# Altium schematic sheet MyMinimig.SchDoc
size 660 x 398 mm
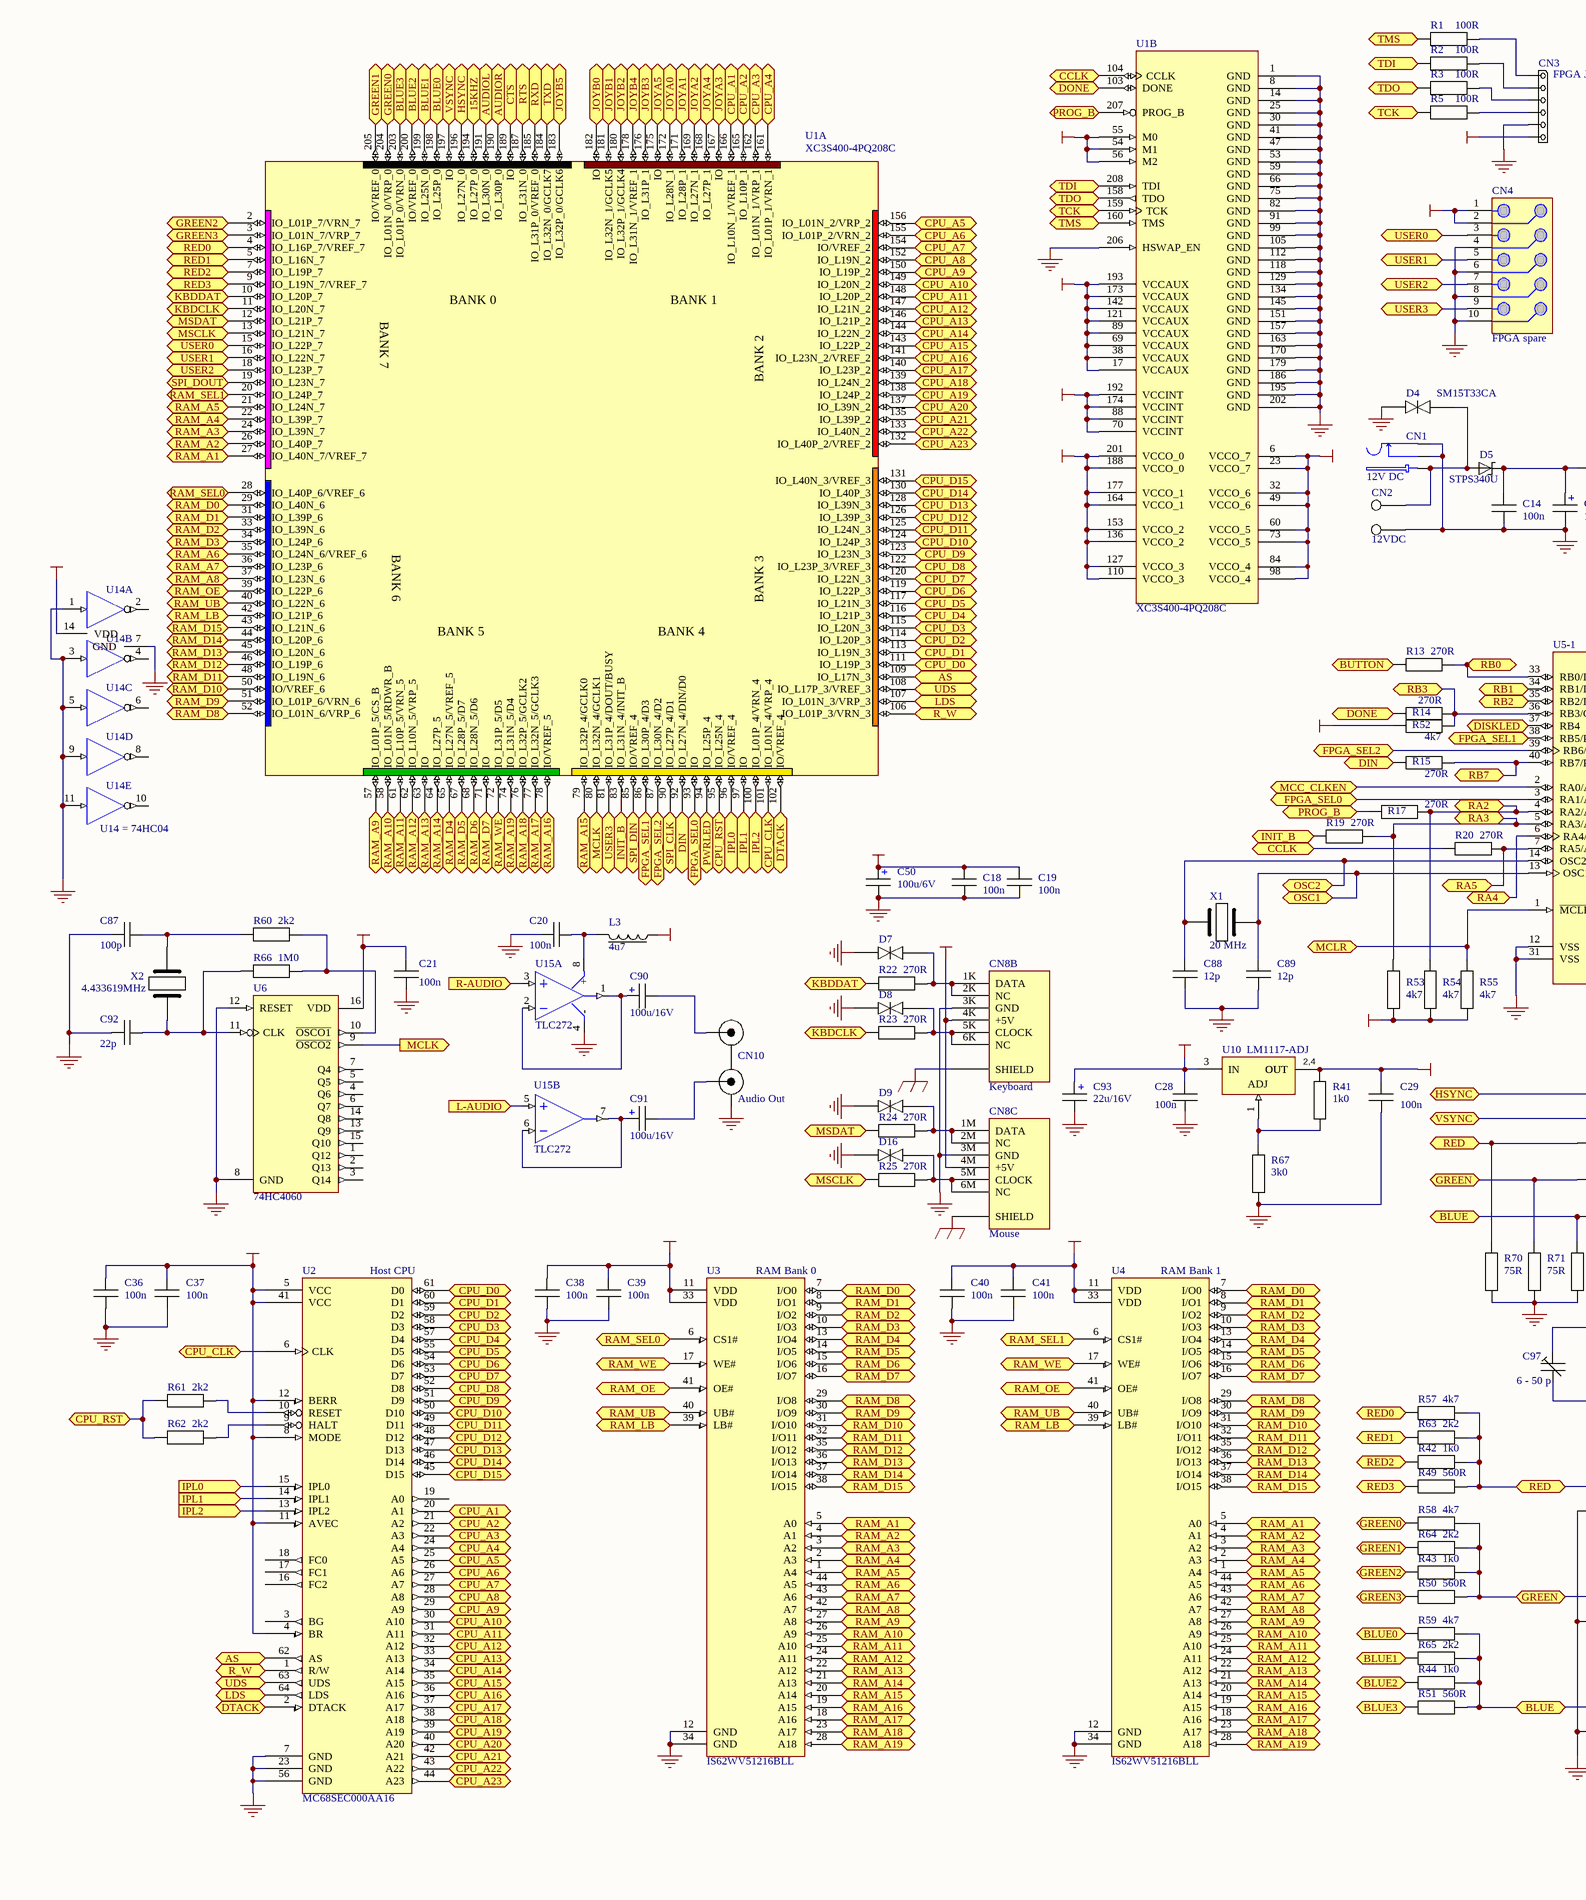
[diagram p0: MyMinimig.SchDoc, bottom left]
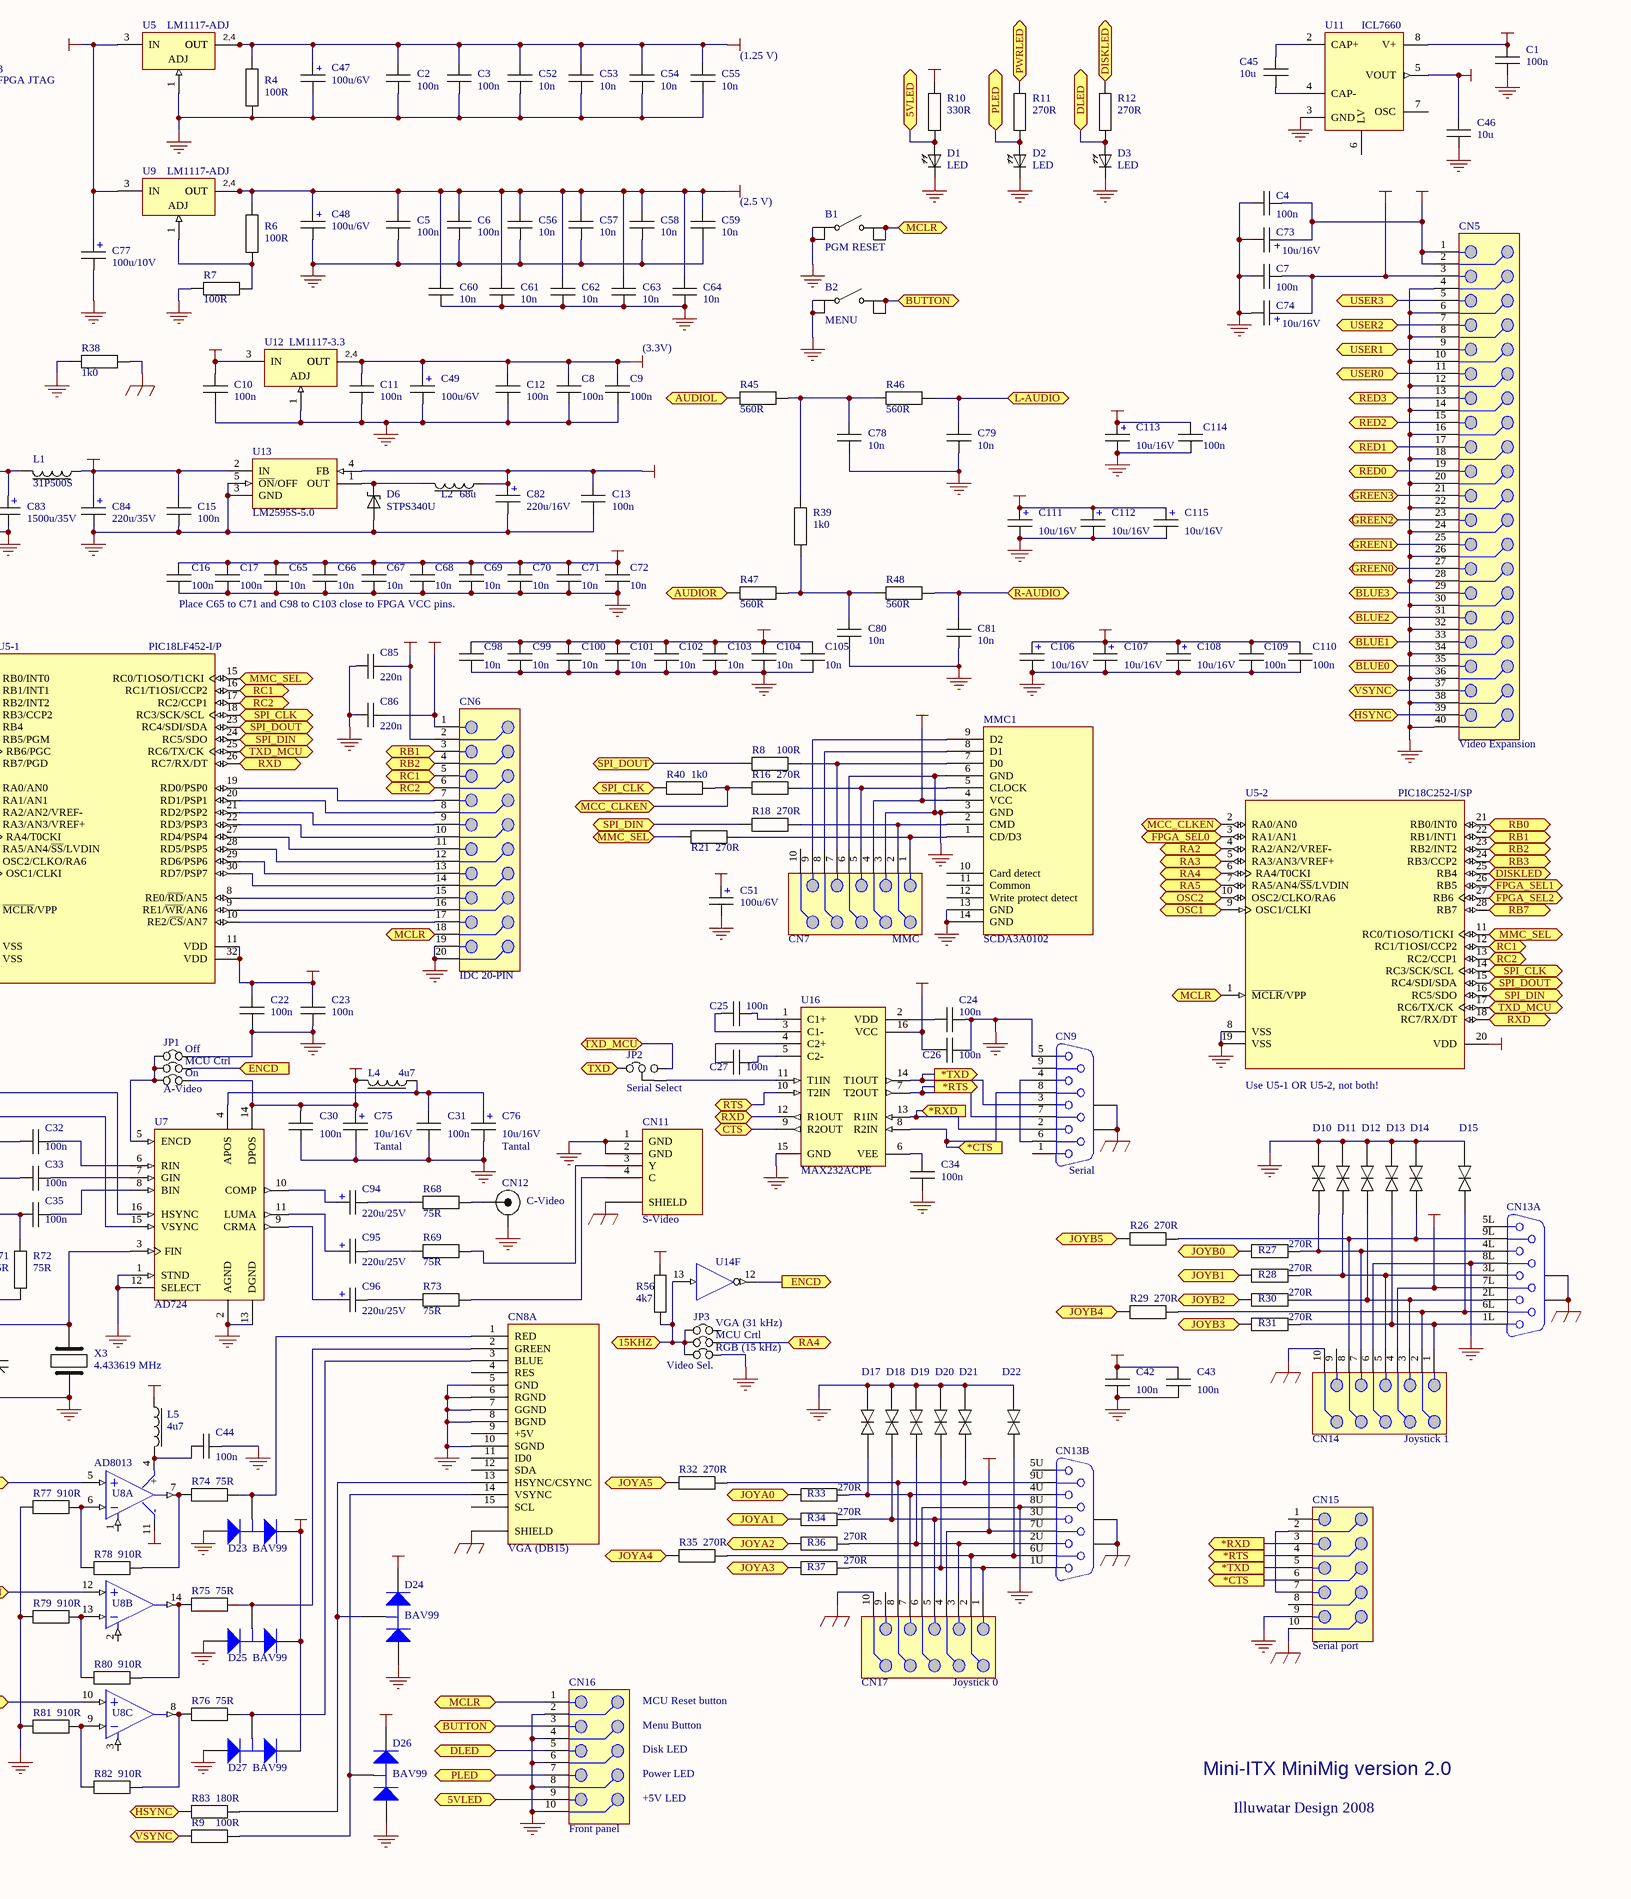
[diagram p1: MyMinimig.SchDoc, bottom right]

## Parts
B1  PGM RESET  [Pushbutton PCB 6x6]
B2  MENU  [Pushbutton PCB 6x6]
C1  100n  [CC2013-0805]
C2  100n  [CC2013-0805]
C3  100n  [CC2013-0805]
C4  100n  [CC2013-0805]
C5  100n  [CC2013-0805]
C6  100n  [CC2013-0805]
C7  100n  [CC2013-0805]
C8  100n  [CC2013-0805]
C9  100n  [CC2013-0805]
C10  100n  [CC2013-0805]
C11  100n  [CC2013-0805]
C12  100n  [CC2013-0805]
C13  100n  [CC2013-0805]
C14  100n  [CC2013-0805]
C15  100n  [CC2013-0805]
C16  100n  [CC2013-0805]
C17  100n  [CC2013-0805]
C18  100n  [CC2013-0805]
C19  100n  [CC2013-0805]
C20  100n  [CC2013-0805]
C21  100n  [CC2013-0805]
C22  100n  [CC2013-0805]
C23  100n  [CC2013-0805]
C24  100n  [CC2013-0805]
C25  100n  [CC2013-0805]
C26  100n  [CC2013-0805]
C27  100n  [CC2013-0805]
C28  100n  [CC2013-0805]
C29  100n  [CC2013-0805]
C30  100n  [CC2013-0805]
C31  100n  [CC2013-0805]
C32  100n  [CC2013-0805]
C33  100n  [CC2013-0805]
C34  100n  [CC2013-0805]
C35  100n  [CC2013-0805]
C36  100n  [CC2013-0805]
C37  100n  [CC2013-0805]
C38  100n  [CC2013-0805]
C39  100n  [CC2013-0805]
C40  100n  [CC2013-0805]
C41  100n  [CC2013-0805]
C42  100n  [CC2013-0805]
C43  100n  [CC2013-0805]
C44  100n  [CC2013-0805]
C45  10u  [CC3216-1206]
C46  10u  [CC3216-1206]
C47  100u/6V  [TC7343-2917]
C48  100u/6V  [TC7343-2917]
C49  100u/6V  [TC7343-2917]
C50  100u/6V  [TC7343-2917]
C51  100u/6V  [TC7343-2917]
C52  10n  [CC2013-0805]
C53  10n  [CC2013-0805]
C54  10n  [CC2013-0805]
C55  10n  [CC2013-0805]
C56  10n  [CC2013-0805]
C57  10n  [CC2013-0805]
C58  10n  [CC2013-0805]
C59  10n  [CC2013-0805]
C60  10n  [CC2013-0805]
C61  10n  [CC2013-0805]
C62  10n  [CC2013-0805]
C63  10n  [CC2013-0805]
C64  10n  [CC2013-0805]
C65  10n  [CC2013-0805]
C66  10n  [CC2013-0805]
C67  10n  [CC2013-0805]
C68  10n  [CC2013-0805]
C69  10n  [CC2013-0805]
C70  10n  [CC2013-0805]
C71  10n  [CC2013-0805]
C72  10n  [CC2013-0805]
C73  10u/16V  [TC3528-1411]
C74  10u/16V  [TC3528-1411]
C75  10u/16V  [TC3528-1411]
C76  10u/16V  [TC3528-1411]
C77  100u/10V  [TC7343-2917]
C78  10n  [RAD-0.2]
C79  10n  [RAD-0.2]
C80  10n  [RAD-0.2]
C81  10n  [RAD-0.2]
C82  220u/16V  [Cap-E 6.6]
C83  1500u/35V  [Cap-E 16.3]
C84  220u/35V  [Cap-E 8.3]
C85  220n  [CC2013-0805]
C86  220n  [CC2013-0805]
C87  100p  [CC2013-0805]
C88  12p  [CC2013-0805]
C89  12p  [CC2013-0805]
C90  100u/16V  [R-0.15/3.2]
C91  100u/16V  [R-0.15/3.2]
C92  22p  [CC2013-0805]
C93  22u/16V  [TC6032-2412]
C94  220u/25V  [Cap-E 8.3]
C95  220u/25V  [Cap-E 8.3]
C96  220u/25V  [Cap-E 8.3]
C97  6 - 50 p  [Trimmer Cap TZ03]
C98  10n  [CC2013-0805]
C99  10n  [CC2013-0805]
C100  10n  [CC2013-0805]
C101  10n  [CC2013-0805]
C102  10n  [CC2013-0805]
C103  10n  [CC2013-0805]
C104  10n  [CC2013-0805]
C105  10n  [CC2013-0805]
C106  10u/16V  [TC3528-1411]
C107  10u/16V  [TC3528-1411]
C108  10u/16V  [TC3528-1411]
C109  100n  [CC2013-0805]
C110  100n  [CC2013-0805]
C111  10u/16V  [TC3528-1411]
C112  10u/16V  [TC3528-1411]
C113  10u/16V  [TC3528-1411]
C114  100n  [CC2013-0805]
C115  10u/16V  [TC3528-1411]
CN1  12V DC  [CHASSIDON 2.1/2.5mm]
CN2  12VDC  [CONN_1]
CN3  FPGA JTAG  [6-PIN STRIP]
CN4  FPGA spare  [N_IDC10]
CN5  Video Expansion  [40-pin Header SMD 1.27 mm]
CN6  IDC 20-PIN  [N_IDC20]
CN7  MMC  [N_IDC10]
CN8  VGA + 2 x PS/2  [VGA + 2 x PS/2]  (value not drawn)  (parts A,B,C of 3)
CN9  Serial  [DB9 Female PCB]
CN10  Audio Out  [Dual Phono PCB]
CN11  S-Video  [S-Video connector]
CN12  C-Video  [RCA RCJ-04X]
CN13  Dual DB9  [Dual DB9 male]  (value not drawn)  (parts A,B of 2)
CN14  Joystick 1  [N_IDC10]
CN15  Serial port  [N_IDC10]
CN16  Front panel  [N_IDC10]
CN17  Joystick 0  [N_IDC10]
D1  LED  [LED 3MM]
D2  LED  [LED 3MM]
D3  LED  [LED 3MM]
D4  SM15T33CA  [SOD15 UP]
D5  STPS340U  [DO-214AA SMB]
D6  STPS340U  [DO-214AA SMB]
D7  ESD  [CR1608-0603]  (value not drawn)
D8  ESD  [CR1608-0603]  (value not drawn)
D9  ESD  [CR1608-0603]  (value not drawn)
D10  ESD  [CR1608-0603]  (value not drawn)
D11  ESD  [CR1608-0603]  (value not drawn)
D12  ESD  [CR1608-0603]  (value not drawn)
D13  ESD  [CR1608-0603]  (value not drawn)
D14  ESD  [CR1608-0603]  (value not drawn)
D15  ESD  [CR1608-0603]  (value not drawn)
D16  ESD  [CR1608-0603]  (value not drawn)
D17  ESD  [CR1608-0603]  (value not drawn)
D18  ESD  [CR1608-0603]  (value not drawn)
D19  ESD  [CR1608-0603]  (value not drawn)
D20  ESD  [CR1608-0603]  (value not drawn)
D21  ESD  [CR1608-0603]  (value not drawn)
D22  ESD  [CR1608-0603]  (value not drawn)
D23  BAV99  [SOT-23]
D24  BAV99  [SOT-23]
D25  BAV99  [SOT-23]
D26  BAV99  [SOT-23]
D27  BAV99  [SOT-23]
JP1  A-Video  [STRAP-3]
JP2  Serial Select  [STRAP-3pin]
JP3  Video Sel.  [STRAP-3]
L1  31P500S  [CR3216-1206]
L2  68u  [DR74]
L3  4u7  [CR3225-1210]
L4  4u7  [CR3225-1210]
L5  4u7  [CR3225-1210]
MMC1  SCDA3A0102  [SCDA3A0102]
R1  100R  [CR2012-0805]
R2  100R  [CR2012-0805]
R3  100R  [CR2012-0805]
R4  100R  [CR2012-0805]
R5  100R  [CR2012-0805]
R6  100R  [CR2012-0805]
R7  100R  [CR2012-0805]
R8  100R  [CR2012-0805]
R9  100R  [CR2012-0805]
R10  330R  [CR3216-1206]
R11  270R  [CR3216-1206]
R12  270R  [CR3216-1206]
R13  270R  [CR2012-0805]
R14  270R  [CR2012-0805]
R15  270R  [CR2012-0805]
R16  270R  [CR2012-0805]
R17  270R  [CR2012-0805]
R18  270R  [CR2012-0805]
R19  270R  [CR2012-0805]
R20  270R  [CR2012-0805]
R21  270R  [CR2012-0805]
R22  270R  [CR2012-0805]
R23  270R  [CR2012-0805]
R24  270R  [CR2012-0805]
R25  270R  [CR2012-0805]
R26  270R  [CR2012-0805]
R27  270R  [CR2012-0805]
R28  270R  [CR2012-0805]
R29  270R  [CR2012-0805]
R30  270R  [CR2012-0805]
R31  270R  [CR2012-0805]
R32  270R  [CR2012-0805]
R33  270R  [CR2012-0805]
R34  270R  [CR2012-0805]
R35  270R  [CR2012-0805]
R36  270R  [CR2012-0805]
R37  270R  [CR2012-0805]
R38  1k0  [AXIAL-0.4]
R39  1k0  [CR2012-0805]
R40  1k0  [CR2012-0805]
R41  1k0  [CR2012-0805]
R42  1k0  [CR2012-0805]
R43  1k0  [CR2012-0805]
R44  1k0  [CR2012-0805]
R45  560R  [CR2012-0805]
R46  560R  [CR2012-0805]
R47  560R  [CR2012-0805]
R48  560R  [CR2012-0805]
R49  560R  [CR2012-0805]
R50  560R  [CR2012-0805]
R51  560R  [CR2012-0805]
R52  4k7  [CR2012-0805]
R53  4k7  [CR2012-0805]
R54  4k7  [CR2012-0805]
R55  4k7  [CR2012-0805]
R56  4k7  [CR2012-0805]
R57  4k7  [CR2012-0805]
R58  4k7  [CR2012-0805]
R59  4k7  [CR2012-0805]
R60  2k2  [CR2012-0805]
R61  2k2  [CR2012-0805]
R62  2k2  [CR2012-0805]
R63  2k2  [CR2012-0805]
R64  2k2  [CR2012-0805]
R65  2k2  [CR2012-0805]
R66  1M0  [CR2012-0805]
R67  3k0  [CR2012-0805]
R68  75R  [CR2012-0805]
R69  75R  [CR2012-0805]
R70  75R  [CR2012-0805]
R71  75R  [CR2012-0805]
R72  75R  [CR2012-0805]
R73  75R  [CR2012-0805]
R74  75R  [CR2012-0805]
R75  75R  [CR2012-0805]
R76  75R  [CR2012-0805]
R77  910R  [CR2012-0805]
R78  910R  [CR2012-0805]
R79  910R  [CR2012-0805]
R80  910R  [CR2012-0805]
R81  910R  [CR2012-0805]
R82  910R  [CR2012-0805]
R83  180R  [CR2012-0805]
U1  XC3S400-4PQ208C  [PQ208]  (parts A,B of 2)
U2  MC68SEC000AA16  [QFP14x14-G64/N]
U3  IS62WV51216BLL  [SO-G44/P.8]
U4  IS62WV51216BLL  [SO-G44/P.8]
U5  LM1117-ADJ  [318E-04]
U5-1  PIC18LF452-I/P  [PDIP600-40]
U5-2  PIC18C252-I/SP  [PDIP300-28]
U6  74HC4060  [751B-05]
U7  AD724  [SO-G16/G8.4]
U8  AD8013  [SO-G14]  (parts A,B,C of 3)
U9  LM1117-ADJ  [318E-04]
U10  LM1117-ADJ  [318E-04]
U11  ICL7660  [SO-G8]
U12  LM1117-3.3  [318E-04]
U13  LM2595S-5.0  [TS5B]
U14  MC74HC04AD  [751A-03]  (value not drawn)  (parts A,B,C,D,E,F of 6)
U15  TLC272  [DIP-8]  (parts A,B of 2)
U16  MAX232ACPE  [PE16A]
X1  20 MHz  [XTAL_HC49]
X2  4.433619MHz  [XTAL_HC49]
X3  4.433619 MHz  [XTAL_HC49]

## Ports
5VLED (bidir), 15KHZ (bidir), *CTS (in), *CTS (out), *RTS (out), *RXD (in), *RXD (out), *TXD (out), AS (bidir), AS (out), AUDIOL (bidir), AUDIOR (bidir), BLUE, BLUE0 (bidir), BLUE1 (bidir), BLUE2 (bidir), BLUE3 (bidir), BUTTON (bidir), CCLK (bidir), CPU_A1 (bidir), CPU_A2 (bidir), CPU_A3 (bidir), CPU_A4 (bidir), CPU_A5 (bidir), CPU_A6 (bidir), CPU_A7 (bidir), CPU_A8 (bidir), CPU_A9 (bidir), CPU_A10 (bidir), CPU_A11 (bidir), CPU_A12 (bidir), CPU_A13 (bidir), CPU_A14 (bidir), CPU_A15 (bidir), CPU_A16 (bidir), CPU_A17 (bidir), CPU_A18 (bidir), CPU_A19 (bidir), CPU_A20 (bidir), CPU_A21 (bidir), CPU_A22 (bidir), CPU_A23 (bidir), CPU_CLK (bidir), CPU_D0 (bidir), CPU_D1 (bidir), CPU_D2 (bidir), CPU_D3 (bidir), CPU_D4 (bidir), CPU_D5 (bidir), CPU_D6 (bidir), CPU_D7 (bidir), CPU_D8 (bidir), CPU_D9 (bidir), CPU_D10 (bidir), CPU_D11 (bidir), CPU_D12 (bidir), CPU_D13 (bidir), CPU_D14 (bidir), CPU_D15 (bidir), CPU_RST (bidir), CTS (bidir), DIN (bidir), DISKLED (bidir), DLED (bidir), DONE (bidir), DTACK (bidir), DTACK (in), ENCD (in), ENCD (out), FPGA_SEL0 (bidir), FPGA_SEL1 (bidir), FPGA_SEL2 (bidir), GREEN, GREEN0 (bidir), GREEN1 (bidir), GREEN2 (bidir), GREEN3 (bidir), HSYNC (bidir), INIT_B (bidir), IPL0 (bidir), IPL0 (in), IPL1 (bidir), IPL1 (in), IPL2 (bidir), IPL2 (in), JOYA0 (bidir), JOYA1 (bidir), JOYA2 (bidir), JOYA3 (bidir), JOYA4 (bidir), JOYA5 (bidir), JOYB0 (bidir), JOYB1 (bidir), JOYB2 (bidir), JOYB3 (bidir), JOYB4 (bidir), JOYB5 (bidir), KBDCLK (bidir), KBDDAT (bidir), L-AUDIO, L-AUDIO (in), LDS (bidir), LDS (out), MCC_CLKEN (bidir), MCLK (bidir), MCLK (out), MCLR (bidir), MMC_SEL (bidir), MSCLK (bidir), MSDAT (bidir), OSC1 (bidir), OSC2 (bidir), PLED (bidir), PROG_B (bidir), PWRLED (bidir), R-AUDIO, R-AUDIO (in), R_W (bidir), R_W (out), RA2 (bidir), RA3 (bidir), RA4 (bidir), RA5 (bidir), RAM_A1 (bidir), RAM_A2 (bidir), RAM_A3 (bidir), RAM_A4 (bidir), RAM_A5 (bidir), RAM_A6 (bidir), RAM_A7 (bidir), RAM_A8 (bidir), RAM_A9 (bidir), RAM_A10 (bidir), RAM_A11 (bidir), RAM_A12 (bidir), RAM_A13 (bidir), RAM_A14 (bidir), RAM_A15 (bidir), RAM_A16 (bidir), RAM_A17 (bidir), RAM_A18 (bidir), RAM_A19 (bidir), RAM_D0 (bidir), RAM_D1 (bidir), RAM_D2 (bidir), RAM_D3 (bidir), RAM_D4 (bidir), RAM_D5 (bidir), RAM_D6 (bidir), RAM_D7 (bidir), RAM_D8 (bidir), RAM_D9 (bidir), RAM_D10 (bidir), RAM_D11 (bidir), RAM_D12 (bidir), RAM_D13 (bidir), RAM_D14 (bidir), RAM_D15 (bidir), RAM_LB (bidir), RAM_OE (bidir), RAM_SEL0 (bidir), RAM_SEL1 (bidir), RAM_UB (bidir), RAM_WE (bidir), RB0 (bidir), RB1 (bidir), RB2 (bidir), RB3 (bidir), RB7 (bidir), RC1 (bidir), RC2 (bidir), RED, RED0 (bidir), RED1 (bidir), RED2 (bidir), RED3 (bidir), RTS (bidir), RXD (bidir), SPI_CLK (bidir), SPI_DIN (bidir), SPI_DOUT (bidir), TCK (in), TCK (out), TDI (in), TDI (out), TDO (out), TMS (in), TMS (out), TXD (bidir), TXD_MCU (bidir), UDS (bidir), UDS (out), USER0 (bidir), USER1 (bidir), USER2 (bidir), USER3 (bidir), VSYNC (bidir)

## Nets
+5V: C4.2 C10.2 C13.2 C18.2 C19.2 C42.2 C43.2 C50.1 C73.1 C77.1 C82.1 C86.2 C113.1 C114.2 CN5.1 CN5.2 CN6.1 CN8.4K(+5V) CN8.4M(+5V) CN13.7L CN13.7U CN14.4 CN17.4 L2.2 R10.2 U5.3(IN) U9.3(IN) U12.3(IN) U13.4(FB)
+5V-A: C1.2 C29.1 C30.1 C75.1 JP1.4 L3.2 L4.1 L5.2 R41.2 U7.14(DPOS) U10.2(OUT) U10.4(OUT) U11.8(V+)
+12V: C15.2 C28.1 C84.1 C93.1 L1.2 U10.3(IN) U13.2(IN)
-5V: C46.2 U8.11(-) U11.5(VOUT)
FRAME: CN8.16(SHIELD) CN9.10 CN11.7(SHIELD) CN13.10 CN14.10 CN15.10 CN17.10 R38.2
GND: B1.1 B1.2 B2.1 B2.2 C1.1 C2.1 C3.1 C4.1 C5.1 C6.1 C7.1 C8.1 C9.1 C10.1 C11.1 C12.1 C13.1 C14.1 C15.1 C16.1 C17.1 C18.1 C19.1 C20.1 C21.1 C22.1 C23.1 C24.2 C26.2 C28.2 C29.2 C30.2 C31.2 C34.1 C36.1 C37.1 C38.1 C39.1 C40.1 C41.1 C42.1 C43.1 C44.2 C46.1 C47.2 C48.2 C49.2 C50.2 C51.2 C52.1 C53.1 C54.1 C55.1 C56.1 C57.1 C58.1 C59.1 C60.1 C61.1 C62.1 C63.1 C64.1 C65.1 C66.1 C67.1 C68.1 C69.1 C70.1 C71.1 C72.1 C73.2 C74.2 C75.2 C76.2 C77.2 C78.1 C79.1 C80.1 C81.1 C82.2 C83.2 C84.2 C85.1 C86.1 C87.1 C88.1 C89.1 C92.1 C93.2 C97.1 C98.1 C99.1 C100.1 C101.1 C102.1 C103.1 C104.1 C105.1 C106.2 C107.2 C108.2 C109.1 C110.1 C111.2 C112.2 C113.2 C114.1 C115.2 CN1.1 CN1.2 CN2.2 CN3.5 CN4.4 CN4.6 CN4.8 CN4.10 CN5.4 CN5.6 CN5.8 CN5.10 CN5.12 CN5.14 CN5.16 CN5.18 CN5.20 CN5.22 CN5.24 CN5.26 CN5.28 CN5.30 CN5.32 CN5.34 CN5.36 CN5.38 CN5.40 CN6.19 CN6.20 CN7.3 CN7.6 CN8.3K(GND) CN8.3M(GND) CN8.5(GND) CN8.6(RGND) CN8.7(GGND) CN8.8(BGND) CN8.10(SGND) CN9.5 CN10.1 CN11.1(GND) CN11.2(GND) CN12.1 CN13.8L CN13.8U CN14.6 CN15.9 CN16.2 CN16.4 CN16.6 CN16.8 CN16.10 CN17.6 D1.K D2.K D3.K D4.1 D6.2(A) D7.1 D8.1 D9.1 D10.1 D11.1 D12.1 D13.1 D14.1 D15.1 D16.1 D17.1 D18.1 D19.1 D20.1 D21.1 D22.1 D23.1(A) D24.1(A) D25.1(A) D26.1(A) D27.1(A) JP1.6 JP3.4 MMC1.3(GND) MMC1.6(GND) MMC1.13(GND) MMC1.14(GND) R4.1 R7.1 R38.1 R67.1 R70.1 R71.1 R72.1 R77.1 R79.1 R81.1 U1.1(GND) U1.8(GND) U1.14(GND) U1.25(GND) U1.30(GND) U1.41(GND) U1.47(GND) U1.53(GND) U1.59(GND) U1.66(GND) U1.75(GND) U1.82(GND) U1.91(GND) U1.99(GND) U1.105(GND) U1.112(GND) U1.118(GND) U1.129(GND) U1.134(GND) U1.145(GND) U1.151(GND) U1.157(GND) U1.163(GND) U1.170(GND) U1.179(GND) U1.186(GND) U1.195(GND) U1.202(GND) U1.206(HSWAP_EN) U2.7(GND) U2.23(GND) U2.56(GND) U3.12(GND) U3.34(GND) U4.12(GND) U4.34(GND) U5.1(ADJ) U5-1.12(VSS) U5-1.31(VSS) U5-2.8(VSS) U5-2.19(VSS) U6.8(GND) U6.12(RESET) U7.1(STND) U7.2(AGND) U7.12(SELECT) U7.13(DGND) U11.3(GND) U12.1(ADJ) U13.3(GND) U13.5(~{ON}/OFF) U14.1(IN) U14.3(IN) U14.5(IN) U14.7(GND) U14.9(IN) U14.11(IN) U15.4(-) U16.15(GND) X3.1
NC: U11.1(NC)
VCC: C7.2 C8.2 C9.2 C11.2 C12.2 C16.2 C17.2 C21.2 C22.2 C23.2 C26.1 C36.2 C37.2 C38.2 C39.2 C40.2 C41.2 C49.1 C51.1 C65.2 C66.2 C67.2 C68.2 C69.2 C70.2 C71.2 C72.2 C74.1 C85.2 C98.2 C99.2 C100.2 C101.2 C102.2 C103.2 C104.2 C105.2 C106.1 C107.1 C108.1 C109.2 C110.2 C111.1 C112.1 C115.1 CN3.6 CN4.1 CN4.2 CN5.3 CN6.2 CN7.4 D23.2(K) D24.2(K) D25.2(K) D26.2(K) D27.2(K) MMC1.4(VCC) R52.1 R53.1 R54.1 R55.1 R56.2 U1.6(VCCO_7) U1.23(VCCO_7) U1.32(VCCO_6) U1.49(VCCO_6) U1.60(VCCO_5) U1.73(VCCO_5) U1.84(VCCO_4) U1.98(VCCO_4) U1.110(VCCO_3) U1.127(VCCO_3) U1.136(VCCO_2) U1.153(VCCO_2) U1.164(VCCO_1) U1.177(VCCO_1) U1.188(VCCO_0) U1.201(VCCO_0) U2.4(BR) U2.5(VCC) U2.8(MODE) U2.11(AVEC) U2.12(BERR) U2.41(VCC) U3.11(VDD) U3.33(VDD) U4.11(VDD) U4.33(VDD) U5-1.11(VDD) U5-1.32(VDD) U5-2.20(VDD) U6.16(VDD) U12.2(OUT) U12.4(OUT) U14.14(VCC) U16.16(VCC)  [also labelled VDD]
VCCAUX: C5.2 C6.2 C48.1 C56.2 C57.2 C58.2 C59.2 C60.2 C61.2 C62.2 C63.2 C64.2 R6.2 U1.17(VCCAUX) U1.38(VCCAUX) U1.54(M1) U1.55(M0) U1.56(M2) U1.69(VCCAUX) U1.89(VCCAUX) U1.121(VCCAUX) U1.142(VCCAUX) U1.173(VCCAUX) U1.193(VCCAUX) U9.2(OUT) U9.4(OUT)
VCCINT: C2.2 C3.2 C47.1 C52.2 C53.2 C54.2 C55.2 R4.2 U1.70(VCCINT) U1.88(VCCINT) U1.174(VCCINT) U1.192(VCCINT) U5.2(OUT) U5.4(OUT)
5VLED: CN16.9 D1.A R10.1 ; port 5VLED
15KHZ: JP3.1 JP3.2 JP3.3 R56.1 U1.194(IO_L27P_0) U14.13(IN) ; port 15KHZ
*CTS: CN9.8 CN15.6 U16.8(R2IN) ; port *CTS
*RTS: CN9.7 CN15.4 U16.7(T2OUT) ; port *RTS
*RXD: CN9.2 CN15.3 U16.13(R1IN) ; port *RXD
*TXD: CN9.3 CN15.5 U16.14(T1OUT) ; port *TXD
AS: U1.109(IO_L17N_3) U2.62(AS) ; port AS
AUDIOL: R45.1 U1.191(IO_L30N_0) ; port AUDIOL
AUDIOR: R47.1 U1.190(IO_L30P_0) ; port AUDIOR
BLUE: C35.1 R44.2 R51.2 R59.2 R65.2 R72.2 U8.10 ; port BLUE
BLUE0: CN5.35 R59.1 U1.198(IO_L25P_0) ; port BLUE0
BLUE1: CN5.33 R65.1 U1.199(IO_L25N_0) ; port BLUE1
BLUE2: CN5.31 R44.1 U1.200(IO/VREF_0) ; port BLUE2
BLUE3: CN5.29 R51.1 U1.203(IO_L01P_0/VRN_0) ; port BLUE3
BUTTON: B2.3 B2.4 CN16.3 R13.1 ; port BUTTON
CCLK: R20.1 U1.104(CCLK) ; port CCLK
CPU_A1: U1.166(IO_L10N_1/VREF_1) U2.20(A1) ; port CPU_A1
CPU_A2: U1.165(IO_L10P_1) U2.21(A2) ; port CPU_A2
CPU_A3: U1.162(IO_L01N_1/VRP_1) U2.22(A3) ; port CPU_A3
CPU_A4: U1.161(IO_L01P_1/VRN_1) U2.24(A4) ; port CPU_A4
CPU_A5: U1.156(IO_L01N_2/VRP_2) U2.25(A5) ; port CPU_A5
CPU_A6: U1.155(IO_L01P_2/VRN_2) U2.26(A6) ; port CPU_A6
CPU_A7: U1.154(IO/VREF_2) U2.27(A7) ; port CPU_A7
CPU_A8: U1.152(IO_L19N_2) U2.28(A8) ; port CPU_A8
CPU_A9: U1.150(IO_L19P_2) U2.29(A9) ; port CPU_A9
CPU_A10: U1.149(IO_L20N_2) U2.30(A10) ; port CPU_A10
CPU_A11: U1.148(IO_L20P_2) U2.31(A11) ; port CPU_A11
CPU_A12: U1.147(IO_L21N_2) U2.32(A12) ; port CPU_A12
CPU_A13: U1.146(IO_L21P_2) U2.33(A13) ; port CPU_A13
CPU_A14: U1.144(IO_L22N_2) U2.34(A14) ; port CPU_A14
CPU_A15: U1.143(IO_L22P_2) U2.35(A15) ; port CPU_A15
CPU_A16: U1.141(IO_L23N_2/VREF_2) U2.36(A16) ; port CPU_A16
CPU_A17: U1.140(IO_L23P_2) U2.37(A17) ; port CPU_A17
CPU_A18: U1.139(IO_L24N_2) U2.38(A18) ; port CPU_A18
CPU_A19: U1.138(IO_L24P_2) U2.39(A19) ; port CPU_A19
CPU_A20: U1.137(IO_L39N_2) U2.40(A20) ; port CPU_A20
CPU_A21: U1.135(IO_L39P_2) U2.42(A21) ; port CPU_A21
CPU_A22: U1.133(IO_L40N_2) U2.43(A22) ; port CPU_A22
CPU_A23: U1.132(IO_L40P_2/VREF_2) U2.44(A23) ; port CPU_A23
CPU_CLK: U1.101(IO_L01N_4/VRP_4) U2.6(CLK) ; port CPU_CLK
CPU_D0: U1.111(IO_L19P_3) U2.61(D0) ; port CPU_D0
CPU_D1: U1.113(IO_L19N_3) U2.60(D1) ; port CPU_D1
CPU_D2: U1.114(IO_L20P_3) U2.59(D2) ; port CPU_D2
CPU_D3: U1.115(IO_L20N_3) U2.58(D3) ; port CPU_D3
CPU_D4: U1.116(IO_L21P_3) U2.57(D4) ; port CPU_D4
CPU_D5: U1.117(IO_L21N_3) U2.55(D5) ; port CPU_D5
CPU_D6: U1.119(IO_L22P_3) U2.54(D6) ; port CPU_D6
CPU_D7: U1.120(IO_L22N_3) U2.53(D7) ; port CPU_D7
CPU_D8: U1.122(IO_L23P_3/VREF_3) U2.52(D8) ; port CPU_D8
CPU_D9: U1.123(IO_L23N_3) U2.51(D9) ; port CPU_D9
CPU_D10: U1.124(IO_L24P_3) U2.50(D10) ; port CPU_D10
CPU_D11: U1.125(IO_L24N_3) U2.49(D11) ; port CPU_D11
CPU_D12: U1.126(IO_L39P_3) U2.48(D12) ; port CPU_D12
CPU_D13: U1.128(IO_L39N_3) U2.47(D13) ; port CPU_D13
CPU_D14: U1.130(IO_L40P_3) U2.46(D14) ; port CPU_D14
CPU_D15: U1.131(IO_L40N_3/VREF_3) U2.45(D15) ; port CPU_D15
CPU_RST: R61.1 R62.1 U1.95(IO_L25N_4) ; port CPU_RST
CTS: U1.189(IO) U16.9(R2OUT) ; port CTS
DIN: R15.1 U1.92(IO_L27N_4/DIN/D0) ; port DIN
DISKLED: R12.2 U5-1.37(RB4) U5-2.25(RB4) ; port DISKLED
DLED: CN16.5 D3.A R12.1 ; port DLED
DONE: R14.1 U1.103(DONE) ; port DONE
DTACK: U1.102(IO/VREF_4) U2.2(DTACK) ; port DTACK
ENCD: JP1.5 U14.12(~{OUT}) ; port ENCD
FPGA_SEL0: U1.93(IO) U5-1.3(RA1/AN1) U5-2.3(RA1/AN1) ; port FPGA_SEL0
FPGA_SEL1: U1.86(IO_L30P_4/D3) U5-1.38(RB5/PGM) U5-2.26(RB5) ; port FPGA_SEL1
FPGA_SEL2: U1.87(IO_L30N_4/D2) U5-1.39(RB6/PGC) U5-2.27(RB6) ; port FPGA_SEL2
GREEN: C33.1 R43.2 R50.2 R58.2 R64.2 R71.2 U8.12 ; port GREEN
GREEN0: CN5.27 R58.1 U1.204(IO_L01N_0/VRP_0) ; port GREEN0
GREEN1: CN5.25 R64.1 U1.205(IO/VREF_0) ; port GREEN1
GREEN2: CN5.23 R43.1 U1.2(IO_L01P_7/VRN_7) ; port GREEN2
GREEN3: CN5.21 R50.1 U1.3(IO_L01N_7/VRP_7) ; port GREEN3
HSYNC: CN5.39 R83.1 U1.196(IO_L27N_0) U7.16(HSYNC) ; port HSYNC
INIT_B: R19.1 U1.83(IO_L31N_4/INIT_B) ; port INIT_B
IPL0: U1.96(IO/VREF_4) U2.15(IPL0) ; port IPL0
IPL1: U1.97(IO) U2.14(IPL1) ; port IPL1
IPL2: U1.100(IO_L01P_4/VRN_4) U2.13(IPL2) ; port IPL2
JOYA0: R33.1 U1.172(IO_L28N_1) ; port JOYA0
JOYA1: R34.1 U1.171(IO_L28P_1) ; port JOYA1
JOYA2: R36.1 U1.169(IO_L27N_1) ; port JOYA2
JOYA3: R37.1 U1.167(IO) ; port JOYA3
JOYA4: R35.1 U1.168(IO_L27P_1) ; port JOYA4
JOYA5: R32.1 U1.175(IO) ; port JOYA5
JOYB0: R27.1 U1.182(IO) ; port JOYB0
JOYB1: R28.1 U1.181(IO_L32N_1/GCLK5) ; port JOYB1
JOYB2: R30.1 U1.180(IO_L32P_1/GCLK4) ; port JOYB2
JOYB3: R31.1 U1.176(IO_L31P_1) ; port JOYB3
JOYB4: R29.1 U1.178(IO_L31N_1/VREF_1) ; port JOYB4
JOYB5: R26.1 U1.183(IO_L32P_0/GCLK6) ; port JOYB5
KBDCLK: R23.1 U1.11(IO_L20N_7) ; port KBDCLK
KBDDAT: R22.1 U1.10(IO_L20P_7) ; port KBDDAT
L-AUDIO: C79.2 R46.2 U15.5 ; port L-AUDIO
LDS: U1.107(IO_L01N_3/VRP_3) U2.64(LDS) ; port LDS
MCC_CLKEN: R16.1 R40.2 U5-1.2(RA0/AN0) U5-2.2(RA0/AN0) ; port MCC_CLKEN
MCLK: U1.80(IO_L32N_4/GCLK1) U6.9(~{OSCO2}) ; port MCLK
MCLR: B1.3 B1.4 CN6.18 CN16.1 R55.2 U5-1.1(~{MCLR}/VPP) U5-2.1(~{MCLR}/VPP) ; port MCLR
MMC_SEL: R21.1 U5-1.15(RC0/T1OSO/T1CKI) U5-2.11(RC0/T1OSO/T1CKI) ; port MMC_SEL
MSCLK: R25.1 U1.13(IO_L21N_7) ; port MSCLK
MSDAT: R24.1 U1.12(IO_L21P_7) ; port MSDAT
OSC1: C89.2 U5-1.13(OSC1/CLKI) U5-2.9(OSC1/CLKI) X1.2 ; port OSC1
OSC2: C88.2 U5-1.14(OSC2/CLKO/RA6) U5-2.10(OSC2/CLKO/RA6) X1.1 ; port OSC2
PLED: CN16.7 D2.A R11.1 ; port PLED
PROG_B: R17.1 U1.207(PROG_B) ; port PROG_B
PWRLED: R11.2 U1.94(IO_L25P_4) ; port PWRLED
R-AUDIO: C81.2 R48.2 U15.3 ; port R-AUDIO
R_W: U1.106(IO_L01P_3/VRN_3) U2.1(R/W) ; port R_W
RA2: R17.2 R54.2 U5-1.4(RA2/AN2/VREF-) U5-2.4(RA2/AN2/VREF-) ; port RA2
RA3: R19.2 R53.2 U5-1.5(RA3/AN3/VREF+) U5-2.5(RA3/AN3/VREF+) ; port RA3
RA4: JP3.5 U5-1.6(RA4/T0CKI) U5-2.6(RA4/T0CKI) ; port RA4
RA5: R20.2 U5-1.7(RA5/AN4/~{SS}/LVDIN) U5-2.7(RA5/AN4/~{SS}/LVDIN) ; port RA5
RAM_A1: U1.27(IO_L40N_7/VREF_7) U3.5(A0) U4.5(A0) ; port RAM_A1
RAM_A2: U1.26(IO_L40P_7) U3.4(A1) U4.4(A1) ; port RAM_A2
RAM_A3: U1.24(IO_L39N_7) U3.3(A2) U4.3(A2) ; port RAM_A3
RAM_A4: U1.22(IO_L39P_7) U3.2(A3) U4.2(A3) ; port RAM_A4
RAM_A5: U1.21(IO_L24N_7) U3.1(A4) U4.1(A4) ; port RAM_A5
RAM_A6: U1.35(IO_L24N_6/VREF_6) U3.44(A5) U4.44(A5) ; port RAM_A6
RAM_A7: U1.36(IO_L23P_6) U3.43(A6) U4.43(A6) ; port RAM_A7
RAM_A8: U1.37(IO_L23N_6) U3.42(A7) U4.42(A7) ; port RAM_A8
RAM_A9: U1.57(IO_L01P_5/CS_B) U3.27(A8) U4.27(A8) ; port RAM_A9
RAM_A10: U1.58(IO_L01N_5/RDWR_B) U3.26(A9) U4.26(A9) ; port RAM_A10
RAM_A11: U1.61(IO_L10P_5/VRN_5) U3.25(A10) U4.25(A10) ; port RAM_A11
RAM_A12: U1.62(IO_L10N_5/VRP_5) U3.24(A11) U4.24(A11) ; port RAM_A12
RAM_A13: U1.63(IO) U3.22(A12) U4.22(A12) ; port RAM_A13
RAM_A14: U1.64(IO_L27P_5) U3.21(A13) U4.21(A13) ; port RAM_A14
RAM_A15: U1.79(IO_L32P_4/GCLK0) U3.20(A14) U4.20(A14) ; port RAM_A15
RAM_A16: U1.78(IO/VREF_5) U3.19(A15) U4.19(A15) ; port RAM_A16
RAM_A17: U1.77(IO_L32N_5/GCLK3) U3.18(A16) U4.18(A16) ; port RAM_A17
RAM_A18: U1.76(IO_L32P_5/GCLK2) U3.23(A17) U4.23(A17) ; port RAM_A18
RAM_A19: U1.74(IO_L31N_5/D4) U3.28(A18) U4.28(A18) ; port RAM_A19
RAM_D0: U1.29(IO_L40N_6) U3.7(I/O0) U4.7(I/O0) ; port RAM_D0
RAM_D1: U1.31(IO_L39P_6) U3.8(I/O1) U4.8(I/O1) ; port RAM_D1
RAM_D2: U1.33(IO_L39N_6) U3.9(I/O2) U4.9(I/O2) ; port RAM_D2
RAM_D3: U1.34(IO_L24P_6) U3.10(I/O3) U4.10(I/O3) ; port RAM_D3
RAM_D4: U1.65(IO_L27N_5/VREF_5) U3.13(I/O4) U4.13(I/O4) ; port RAM_D4
RAM_D5: U1.67(IO_L28P_5/D7) U3.14(I/O5) U4.14(I/O5) ; port RAM_D5
RAM_D6: U1.68(IO_L28N_5/D6) U3.15(I/O6) U4.15(I/O6) ; port RAM_D6
RAM_D7: U1.71(IO) U3.16(I/O7) U4.16(I/O7) ; port RAM_D7
RAM_D8: U1.52(IO_L01N_6/VRP_6) U3.29(I/O8) U4.29(I/O8) ; port RAM_D8
RAM_D9: U1.51(IO_L01P_6/VRN_6) U3.30(I/O9) U4.30(I/O9) ; port RAM_D9
RAM_D10: U1.50(IO/VREF_6) U3.31(I/O10) U4.31(I/O10) ; port RAM_D10
RAM_D11: U1.48(IO_L19N_6) U3.32(I/O11) U4.32(I/O11) ; port RAM_D11
RAM_D12: U1.46(IO_L19P_6) U3.35(I/O12) U4.35(I/O12) ; port RAM_D12
RAM_D13: U1.45(IO_L20N_6) U3.36(I/O13) U4.36(I/O13) ; port RAM_D13
RAM_D14: U1.44(IO_L20P_6) U3.37(I/O14) U4.37(I/O14) ; port RAM_D14
RAM_D15: U1.43(IO_L21N_6) U3.38(I/O15) U4.38(I/O15) ; port RAM_D15
RAM_LB: U1.42(IO_L21P_6) U3.39(LB#) U4.39(LB#) ; port RAM_LB
RAM_OE: U1.39(IO_L22P_6) U3.41(OE#) U4.41(OE#) ; port RAM_OE
RAM_SEL0: U1.28(IO_L40P_6/VREF_6) U3.6(CS1#) ; port RAM_SEL0
RAM_SEL1: U1.20(IO_L24P_7) U4.6(CS1#) ; port RAM_SEL1
RAM_UB: U1.40(IO_L22N_6) U3.40(UB#) U4.40(UB#) ; port RAM_UB
RAM_WE: U1.72(IO_L31P_5/D5) U3.17(WE#) U4.17(WE#) ; port RAM_WE
RB0: R13.2 U5-1.33(RB0/INT0) U5-2.21(RB0/INT0) ; port RB0
RB1: CN6.3 U5-1.34(RB1/INT1) U5-2.22(RB1/INT1) ; port RB1
RB2: CN6.4 U5-1.35(RB2/INT2) U5-2.23(RB2/INT2) ; port RB2
RB3: R14.2 R52.2 U5-1.36(RB3/CCP2) U5-2.24(RB3/CCP2) ; port RB3
RB7: R15.2 U5-1.40(RB7/PGD) U5-2.28(RB7) ; port RB7
RC1: CN6.5 U5-1.16(RC1/T1OSI/CCP2) U5-2.12(RC1/T1OSI/CCP2) ; port RC1
RC2: CN6.6 U5-1.17(RC2/CCP1) U5-2.13(RC2/CCP1) ; port RC2
RED: C32.1 R42.2 R49.2 R57.2 R63.2 R70.2 U8.5 ; port RED
RED0: CN5.19 R57.1 U1.4(IO_L16P_7/VREF_7) ; port RED0
RED1: CN5.17 R63.1 U1.5(IO_L16N_7) ; port RED1
RED2: CN5.15 R42.1 U1.7(IO_L19P_7) ; port RED2
RED3: CN5.13 R49.1 U1.9(IO_L19N_7/VREF_7) ; port RED3
RTS: U1.187(IO_L31N_0) U16.10(T2IN) ; port RTS
RXD: U1.185(IO_L31P_0/VREF_0) U5-1.26(RC7/RX/DT) U5-2.18(RC7/RX/DT) U16.12(R1OUT) ; port RXD
SPI_CLK: R40.1 U1.90(IO_L27P_4/D1) U5-1.18(RC3/SCK/SCL) U5-2.14(RC3/SCK/SCL) ; port SPI_CLK
SPI_DIN: R18.1 U1.85(IO/VREF_4) U5-1.24(RC5/SDO) U5-2.16(RC5/SDO) ; port SPI_DIN
SPI_DOUT: R8.1 U1.19(IO_L23N_7) U5-1.23(RC4/SDI/SDA) U5-2.15(RC4/SDI/SDA) ; port SPI_DOUT
TCK: R5.1 U1.159(TCK) ; port TCK
TDI: R2.1 U1.208(TDI) ; port TDI
TDO: R3.1 U1.158(TDO) ; port TDO
TMS: R1.1 U1.160(TMS) ; port TMS
TXD: JP2.1 U1.184(IO_L32N_0/GCLK7) ; port TXD
TXD_MCU: JP2.3 U5-1.25(RC6/TX/CK) U5-2.17(RC6/TX/CK) ; port TXD_MCU
UDS: U1.108(IO_L17P_3/VREF_3) U2.63(UDS) ; port UDS
USER0: CN4.3 CN5.11 U1.15(IO_L22P_7) ; port USER0
USER1: CN4.5 CN5.9 U1.16(IO_L22N_7) ; port USER1
USER2: CN4.7 CN5.7 U1.18(IO_L23P_7) ; port USER2
USER3: CN4.9 CN5.5 U1.81(IO_L31P_4/DOUT/BUSY) ; port USER3
VSYNC: CN5.37 R9.1 U1.197(IO) U7.15(VSYNC) ; port VSYNC
NetC14_2: C14.2 C83.1 D5.1(K) L1.1
NetC20_2: C20.2 L3.1 U15.8(+)
NetC24_1: C24.1 U16.2(VDD)
NetC25_1: C25.1 U16.3(C1-)
NetC25_2: C25.2 U16.1(C1+)
NetC27_1: C27.1 U16.4(C2+)
NetC27_2: C27.2 U16.5(C2-)
NetC31_1: C31.1 C76.1 L4.2 U7.4(APOS)
NetC32_2: C32.2 U7.6(RIN)
NetC33_2: C33.2 U7.7(GIN)
NetC34_2: C34.2 U16.6(VEE)
NetC35_2: C35.2 U7.8(BIN)
NetC44_1: C44.1 L5.1 U8.4(+)
NetC45_1: C45.1 U11.4(CAP-)
NetC45_2: C45.2 U11.2(CAP+)
NetC78_2: C78.2 R39.2 R45.2 R46.1
NetC80_2: C80.2 R39.1 R47.2 R48.1
NetC87_2: C87.2 R60.1 X2.2
NetC90_1: C90.1 U15.1 U15.2
NetC90_2: C90.2 CN10.3
NetC91_1: C91.1 U15.6 U15.7
NetC91_2: C91.2 CN10.2
NetC92_2: C92.2 R66.1 U6.11(CLK) X2.1
NetC94_1: C94.1 U7.10(COMP)
NetC94_2: C94.2 R68.1
NetC95_1: C95.1 U7.11(LUMA)
NetC95_2: C95.2 R69.1
NetC96_1: C96.1 U7.9(CRMA)
NetC96_2: C96.2 R73.1
NetC97_2: C97.2 U7.3(FIN) X3.2
NetCN1_3: CN1.3 CN2.1 D4.2 D5.2(A)
NetCN3_1: CN3.1 R1.2
NetCN3_2: CN3.2 R2.2
NetCN3_3: CN3.3 R3.2
NetCN3_4: CN3.4 R5.2
NetCN6_7: CN6.7 U5-1.19(RD0/PSP0)
NetCN6_8: CN6.8 U5-1.20(RD1/PSP1)
NetCN6_9: CN6.9 U5-1.21(RD2/PSP2)
NetCN6_10: CN6.10 U5-1.22(RD3/PSP3)
NetCN6_11: CN6.11 U5-1.27(RD4/PSP4)
NetCN6_12: CN6.12 U5-1.28(RD5/PSP5)
NetCN6_13: CN6.13 U5-1.29(RD6/PSP6)
NetCN6_14: CN6.14 U5-1.30(RD7/PSP7)
NetCN6_15: CN6.15 U5-1.8(RE0/~{RD}/AN5)
NetCN6_16: CN6.16 U5-1.9(RE1/~{WR}/AN6)
NetCN6_17: CN6.17 U5-1.10(RE2/~{CS}/AN7)
NetCN7_1: CN7.1 MMC1.1(CD/D3) R21.2
NetCN7_2: CN7.2 MMC1.2(CMD) R18.2
NetCN7_5: CN7.5 MMC1.5(CLOCK) R16.2
NetCN7_7: CN7.7 MMC1.7(D0) R8.2
NetCN7_8: CN7.8 MMC1.8(D1)
NetCN7_9: CN7.9 MMC1.9(D2)
NetCN8_1: CN8.1(RED) D23.3(C) R74.2
NetCN8_1K: CN8.1K(DATA) CN8.2K(NC) D7.2 R22.2
NetCN8_1M: CN8.1M(DATA) CN8.2M(NC) D9.2 R24.2
NetCN8_2: CN8.2(GREEN) D25.3(C) R75.2
NetCN8_3: CN8.3(BLUE) D27.3(C) R76.2
NetCN8_5K: CN8.5K(CLOCK) CN8.6K(NC) D8.2 R23.2
NetCN8_5M: CN8.5M(CLOCK) CN8.6M(NC) D16.2 R25.2
NetCN8_13: CN8.13(HSYNC/CSYNC) D24.3(C) R83.2
NetCN8_14: CN8.14(VSYNC) D26.3(C) R9.2
NetCN9_4: CN9.4 CN9.6
NetCN11_3: CN11.3(Y) R69.2
NetCN11_4: CN11.4(C) R73.2
NetCN12_2: CN12.2 R68.2
NetCN13_1L: CN13.1L CN14.1 D13.2 R31.2
NetCN13_1U: CN13.1U CN17.1 D20.2 R37.2
NetCN13_2L: CN13.2L CN14.3 D12.2 R30.2
NetCN13_2U: CN13.2U CN17.3 D19.2 R36.2
NetCN13_3L: CN13.3L CN14.5 D11.2 R28.2
NetCN13_3U: CN13.3U CN17.5 D18.2 R34.2
NetCN13_4L: CN13.4L CN14.7 D10.2 R27.2
NetCN13_4U: CN13.4U CN17.7 D17.2 R33.2
NetCN13_6L: CN13.6L CN14.2 D15.2 R29.2
NetCN13_6U: CN13.6U CN17.2 D22.2 R35.2
NetCN13_9L: CN13.9L CN14.8 D14.2 R26.2
NetCN13_9U: CN13.9U CN17.8 D21.2 R32.2
NetCN15_2: CN15.2 CN15.7
NetD6_1: D6.1(K) L2.1 U13.1(OUT)
NetJP1_1: JP1.1 JP1.2 JP1.3 U7.5(ENCD)
NetJP2_2: JP2.2 U16.11(T1IN)
NetR6_1: R6.1 R7.2 U9.1(ADJ)
NetR41_1: R41.1 R67.2 U10.1(ADJ)
NetR60_2: R60.2 R66.2 U6.10(~{OSCO1})
NetR61_2: R61.2 U2.10(RESET)
NetR62_2: R62.2 U2.9(HALT)
NetR74_1: R74.1 R78.2 U8.7
NetR75_1: R75.1 R80.2 U8.14
NetR76_1: R76.1 R82.2 U8.8
NetR77_2: R77.2 R78.1 U8.6
NetR79_2: R79.2 R80.1 U8.13
NetR81_2: R81.2 R82.1 U8.9

Not connected (* = marked no-connect by the designer): CN7 10; CN8 4(RES) 9(+5V) 11(ID0) 12(SDA) 15(SCL); CN9 1 9; CN13 5L 5U; CN14 9; CN15 1 8; CN17 9; JP3 6; MMC1 10(Card_detect) 11(Common) 12(Write_protect_detect); U2 3(BG) 16(FC2) 17(FC1) 18(FC0) 19(A0); U6 1(Q12) 2(Q13) 3(Q14) 4(Q6) 5(Q5) 6(Q7) 7(Q4) 13(Q9) 14(Q8) 15(Q10); U8 1(D1) 2(D2) 3(D3); U11 6(LV) 7(OSC); U14 2(~{OUT}) 4(~{OUT}) 6(~{OUT}) 8(~{OUT}) 10(~{OUT})

## Notes on the sheet
- (near C55) (1.25 V)
- (2.5 V)
- (3.3V)
- Place C65 to C71 and C98 to C103 close to FPGA VCC pins.
- (near U14) U14 = 74HC04
- (near JP1) Off
- (near CN8) Keyboard
- (near JP1) MCU Ctrl
- (near JP1) On
- (near U5-2) Use U5-1 OR U5-2, not both!
- Tantal
- (near C76) Tantal
- (near CN8) Mouse
- (near U2) Host CPU
- (near U3) RAM Bank 0
- (near U4) RAM Bank 1
- (near JP3) VGA (31 kHz)
- (near JP3) MCU Crtl
- (near JP3) RGB (15 kHz)
- (near CN8) VGA (DB15)
- MCU Reset button
- Power LED
- Disk LED
- Menu Button
- Mini-ITX MiniMig version 2.0
- +5V LED
- Illuwatar Design 2008
- (in symbol LM317MSTT3) 2,4
- (in symbol XC3S400-4PQ208C, part A) BANK 0; BANK 1; BANK 7; BANK 2; BANK 6; BANK 3; BANK 5; BANK 4

## Library data of the parts
B1 B2 = ALPS PCB BUTTON 6X6: PCB Pushbutton ALPS 6 x 6 mm
C1-C46 C52-C72 C85-C89 C92 C98-C105 C109 C110 C114 = CAP SMD: SMD Capacitors
C47-C51 = ELYT SMD1: SMD Electrolytics - square can footprint; Elfa: 67-741-52
C73-C76 C106-C108 C111-C113 C115 = ELYT SMD1: SMD Electrolytics - square can footprint; Elfa: 67-747-07
C77 = ELYT SMD1: SMD Electrolytics - square can footprint; Elfa: 67-743-35
C78-C81 = CAP RADIAL
C82 = ELYT SMD1: SMD Electrolytics - square can footprint; Elfa: 67-134-40
C83 = ELYT SMD1: SMD Electrolytics - square can footprint; Elfa: 67-222-84
C84 = ELYT SMD1: SMD Electrolytics - square can footprint; Elfa: 67-134-24
C90 C91 = ELYT RADIAL
C93 = ELYT SMD1: SMD Electrolytics - square can footprint; Elfa: 67-747-23
C94-C96 = ELYT SMD1: SMD Electrolytics - square can footprint; Elfa: 67-217-32
C97 = Trim-Cap TZ03: TZ03 Trimmer Capacitor; Elfa: 68-000-23
CN1 = Chassidon 2.1/2.5mm: Batterieliminatordon Chassidon 2.1/2.5 mm; Elfa: 42-051-59
CN2 = CON 2-PIN SMALL: Small 2-pin connector (2.54 mm)
CN3 = 6-PIN CON. STRIP: 6-pin Connection strip
CN4 CN7 CN14-CN17 = IDC 10-PIN: IDC 10-pin header
CN5 = 2 x 20 Header, 1.27 mm spacing: 2 x 20 pin Header, 1.27 mm spacing, hole-through or SMD; Elfa: 43-912-80
CN6 = IDC 20-PIN: IDC 20-pin header
CN8 = VGA & 2 x PS/2: VGA (DB15) and 2 x PS/2 in a single unit; Digikey: 999-H15FA-ND
CN9 = 9-PIN DSUB Female: D-Sub female connector, 9 pins
CN10 = Dual RCA, PCB, RCJ-22XX: Dual RCA for PCB, RCJ-22X; Digikey: CP-1433-ND
CN11 = S-VIDEO CONNECTOR: PS2 Keyboard/mouse female PCB connector; Digikey: CP-5040-ND
CN12 = PCB RCA RCJ-04X: Single RCA-connector PCB, RCJ-04X; Digikey: CP-1421-ND
CN13 = Dual DB9 Male connector: Dual DB9 male connector for PCB; Digikey: 1109MME-ND
D1-D3 = LED: Hole mounted LED
D4 = SM15T Protection Diode: Transil diode - over-voltage protection; Elfa: 70-412-70
D5 D6 = STP340U: 3A/40V SMD Schottky-diode; Elfa: 70-288-48
D7-D22 = ESD-diode CeraDiode: Single SMD ESD-protection diode; Elfa: 70-156-96
D23-D27 = BAV99: Silicon Switching Diode Array for High-Speed Switching; Package Information: Latest Revision: Sep-2001; Published: 21-Mar-2003; Datasheet: Latest Revision: Oct-1999; Package Reference: SOT-23; Publisher: Altium Limited
JP1 JP3 = 3-STRAPBLOCK: Triple straps
JP2 = 3-PIN STRAPBLOCK: 3-pin alternating strap block
L1 = INDUCTOR: Generic inductor; Elfa: 58-789-21
L2 = SMD Inductor DR127: SMD inductor DR127 (Cooper Bussmann); Elfa: 58-103-61
L3 L5 = INDUCTOR: Generic inductor
L4 = INDUCTOR: Generic inductor; Elfa: 58-853-30
MMC1 = MMC/SD Holder SCDA3A0102: SMD card holder for SD/MMC cards, ALPS SCDA3A0102; Electrokit: 41003193; Elfa: 48-075-17
R1-R83 = RES SMALL: Generic Resistor
U1 = XC3S400-4PQ208C: Spartan-3 1.2V FPGA, 141 User I/Os, 208-pin PQFP, Standard Performance, Commercial Grade; Package Information: Latest Revision: ver1.1, Oct-2002; Code - JEDEC: MS-029-FA-1; Published: 17-Sep-2003; Datasheet: Latest Revision: Dec-2003; Package Reference: PQ208; Publisher: Altium Limited; Digikey: 122-1519-ND
U2 = MC68SEC000: Freescale 68k-clone, 3.3V version; Digikey: MC68SEC000AA16-ND
U3 U4 = IS62WV51216BLL: 512 x 16 bit low-voltage static RAM; Digikey: 706-1048-ND
U5 U9 U10 U12 = LM317MSTT3: Three-Terminal Adjustable Output Positive Voltage Regulator; Package Information: Latest Revision: Nov-1999; Note: Pin 2 is electrically connected to Pin 4 (TAB); Published: 15-Apr-2002; Datasheet: Latest Revision: Nov-1999; Package Reference: 318E-04; Publisher: Altium Limited
U5-1 = PIC18LF452-I/P: High Performance, Enhanced FLASH Microcontroller with 10-Bit A/D, 32K FLASH, 40-Pin PDIP, Wide Volt Range, Industrial Temperature; PackageDocument: 2003; Note: Pin compatible with 40-pin PIC16C7X devices.; Note: RB3 is the alternate pin for the CCP2 pin multiplexing.; Published: 11-Oct-2004; LatestRevisionDate: 4-Mar-2005; LatestRevisionNote: Stylized 3D Model Added.; DatasheetDocument: DS39564B_2002; PackageReference: PDIP600-40; Publisher: Altium Limited; Code_JEDEC: MO-011; ComponentLink1Description: Manufacturer Link; ComponentLink1URL: http://www.microchip.com/index.asp; ComponentLink2Description: Datasheet; ComponentLink2URL: http://ww1.microchip.com/downloads/en/DeviceDoc/39564b.pdf; ComponentLink3Description: Packaging Specification; ComponentLink3URL: http://ww1.microchip.com/downloads/en/PackagingSpec/00049AD.pdf; Digikey: PIC18LF452-I/P-ND
U5-2 = PIC18C252-I/SP: High Performance Microcontroller with 10-Bit A/D, 32K EPROM, 28-Pin Skinny PDIP, Standard Volt Range, Industrial Temperature; PackageDocument: DS00049W_2003; Note: Pin compatible with 28-pin PIC16C7X devices.; Note: Not recommended for new designs. Consider PIC18F252 instead.; Note: RB3 is the alternate pin for the CCP2 pin multiplexing.; Published: 11-Oct-2004; LatestRevisionDate: 4-Mar-2005; LatestRevisionNote: Stylized 3D Model Added.; DatasheetDocument: DS39026C_2001; PackageReference: PDIP300-28; Publisher: Altium Limited; Code_JEDEC: MO-095; ComponentLink1Description: Manufacturer Link; ComponentLink1URL: http://www.microchip.com/index.asp; ComponentLink2Description: Datasheet; ComponentLink2URL: http://ww1.microchip.com/downloads/en/DeviceDoc/39026c.pdf; ComponentLink3Description: Packaging Specification; ComponentLink3URL: http://ww1.microchip.com/downloads/en/PackagingSpec/00049AD.pdf; Digikey: PIC18LF252-I/SP-ND
U6 = MC74HC4060AD: 14-Stage Binary Ripple Counter with Oscillator; Package Information: Latest Revision: Oct-1999; Code - JEDEC: MS-012-AC; Code - IPC: SO16; Published: 15-Apr-2002; Datasheet: Latest Revision: Mar-2000; Package Reference: 751B-05; Publisher: Altium Limited
U7 = AD724: RGB to Composite & S-Video (PAL/NTSC); Digikey: AD724JRZ-ND
U8 = AD8013: Single Supply, Low Power, / Triple Video Amplifier
U11 = ICL7660: Power converter +V -> -V (1.5 to 15V)
U13 = LM2595S-5.0: Simple Switcher Power Converter 150 kHz 1A Step Down Voltage Regulator; Note: Tab is connected to GND; Elfa: 73-068-33; Published: 15-Apr-2002; Datasheet: Latest Revision: May-1999; Package Reference: TS5B; Publisher: Altium Limited
U14 = MC74HC04AD: Hex Inverter; Code - JEDEC: MS-012-AB; Code - IPC: SO14; Published: 15-Apr-2002; Datasheet: Latest Revision: Mar-2000; Package Reference: 751A-03; Publisher: Altium Limited
U15 = NE5532: Dual Low Noise Operation Amplifier; Digikey: 296-1824-5-ND
U16 = MAX232ACPE: +5V Powered, Multi-Channel RS-232 Driver/Receiver; PackageDocument: 1997; Published: 16-Jan-2001; LatestRevisionDate: 6-Jun-2005; LatestRevisionNote: Stylized 3D Model Added.; PackageReference: PE16A; Publisher: Altium Limited; Code_JEDEC: MS-001-BB; ComponentLink1Description: Manufacturer Link; ComponentLink1URL: http://www.maxim-ic.com/; ComponentLink2Description: Datasheet; ComponentLink2URL: http://pdfserv.maxim-ic.com/en/ds/MAX220-MAX249.pdf
X1-X3 = CRYSTAL